# Altium schematic sheet Sheet.SchDoc
size 254 x 177 mm; SheetNumber: 1; SheetTotal: 1
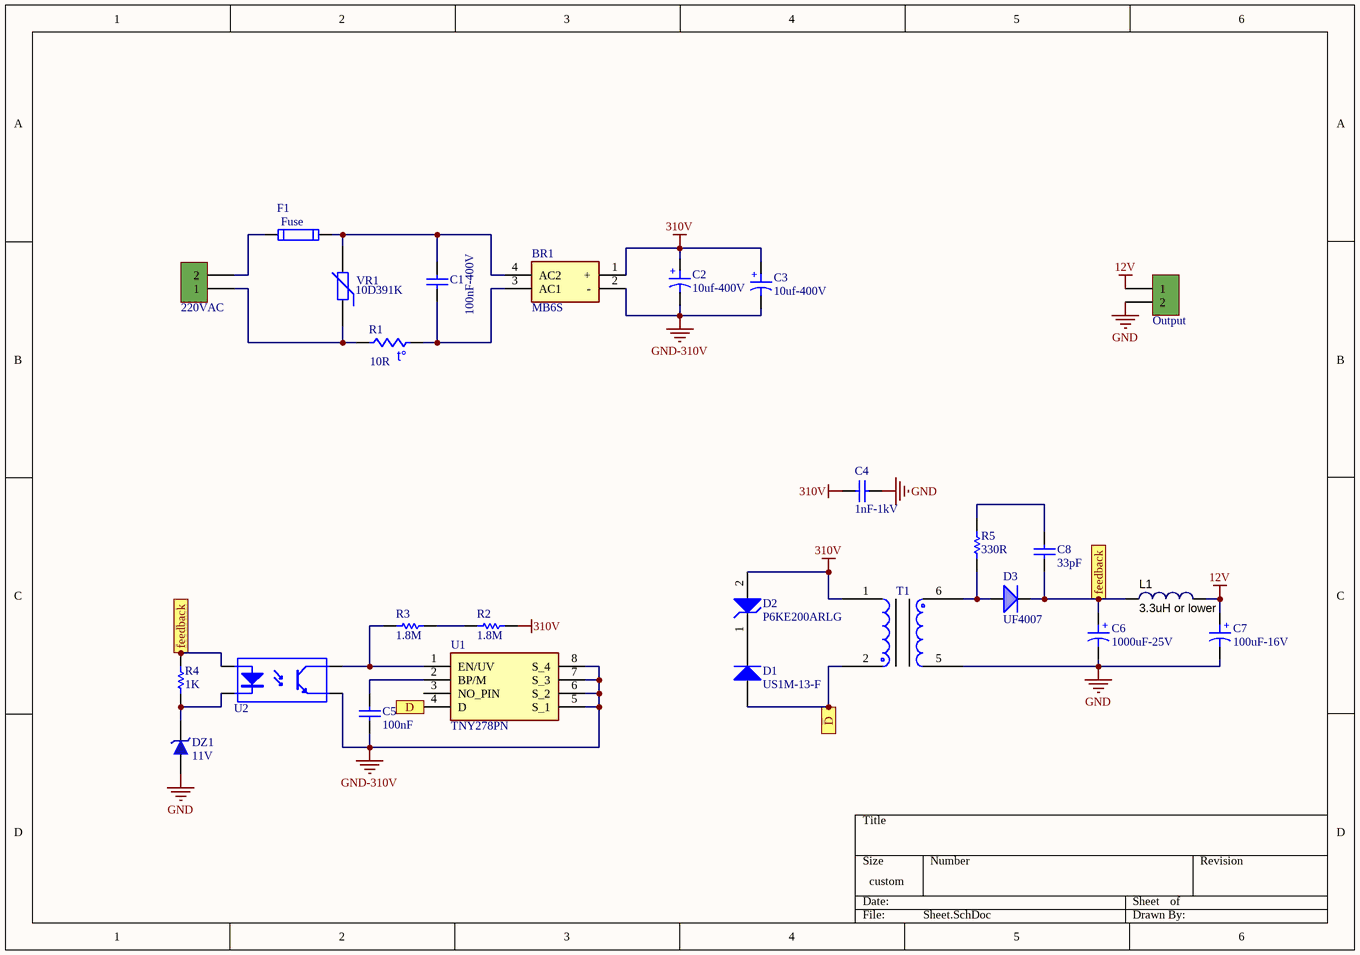
[diagram p0: Sheet.SchDoc]

## Parts
220VAC  Phoenix 2 Pin  [Phoenix_2PIN_RA_P5.08mm]  (value not drawn)
BR1  MB6S  [SOP250P700X270-4N]
C1  100nF-400V  [Cap-100nF-400V]
C2  10uf-400V  [Cap electrolitic radial 10x16-5]
C3  10uf-400V  [Cap electrolitic radial 10x16-5]
C4  1nF-1kV  [CAP1206]
C5  100nF  [CAP805]
C6  1000uF-25V  [Cap electrolitic radial 10x16-5]
C7  100uF-16V  [Cap electrolitic radial 5x11-2]
C8  33pF  [CAP805]
D1  US1M-13-F  [DIOD-SMA-2_A_V]
D2  P6KE200ARLG  [ONSC-SURMETIC40-2-017AA-01]
D3  UF4007  [DO-41]
DZ1  11V  [SOD80, LL-34]
F1  FUSE_HOLDER_METAL  [FUSE_5X20MM_4PIN]  (value not drawn)
L1  3.3uH or lower  [Inductor SMD 3x3.2mm]
Output  Phoenix 2 Pin  [Phoenix_2PIN_RA_P5.08mm]  (value not drawn)
R1  value 10R  [NTC_9]  (hidden comment: 10R[20%])
R2  1.8M  [RES0805_(2012X06L)]
R3  1.8M  [RES0805_(2012X06L)]
R4  1K  [RES0805_(2012X06L)]
R5  330R  [RES0805_(2012X06L)]
T1  EE19-12V  [PCBComponent_1]  (value not drawn)
U1  TNY278PN  [DIP762W56P254L958H406Q8N]
U2  PC817  [SOP4]  (value not drawn)
VR1  10D391K  [10D XXX]

## Ports
D (see Sheet[2C]), D (see Sheet[4D]), feedback (see Sheet[1C]), feedback (see Sheet[5C])

## Nets
12V: C7.1 L1.2 Output.1
310V: BR1.1(+) C2.1 C3.1 C4.2 D2.2(A) R2.2 T1.1
GND: C4.1 C6.2 C7.2 DZ1.1 Output.2 T1.5
GND-310V: BR1.2(-) C2.2 C3.2 C5.1 U1.5(S_1) U1.6(S_2) U1.7(S_3) U1.8(S_4) U2.3(E)
D: D1.1(A) T1.2 U1.4(D) ; port D
feedback: C6.1 C8.1 D3.2(CATHODE) L1.1 R4.2 U2.1(A) ; port feedback
Net220VAC_1: 220VAC.1 R1.1 VR1.1
Net220VAC_2: 220VAC.2 F1.1
NetBR1_3: BR1.3(AC1) C1.2 R1.2
NetBR1_4: BR1.4(AC2) C1.1 F1.2 VR1.2
NetC5_2: C5.2 U1.2(BP/M)
NetC8_2: C8.2 R5.2
NetD1_2: D1.2(K) D2.1(K)
NetD3_1: D3.1(ANODE) R5.1 T1.6
NetDZ1_2: DZ1.2 R4.1 U2.2(K)
NetR2_1: R2.1 R3.2
NetR3_1: R3.1 U1.1(EN/UV) U2.4(C)

Not connected (* = marked no-connect by the designer): U1 3(NO_PIN)

## Notes on the sheet
- (in symbol Cap ELECTROLITIC TOTAL SIZE) +
- (in symbol FUSE METAL 4PIN) Fuse
- (in symbol NTC10D-9) t°

## Library data of the parts
BR1 = MB6S: Bridge Rectifier; Manufacturer_Name: HY Electronic Corp; Datasheet Link: http://docs-emea.rs-online.com/webdocs/14bb/0900766b814bbf67.pdf; Height: 2.7mm; Manufacturer_Part_Number: MB6S
C1 = CAP CERAMIC TOTAL SIZE: CAP Ceramic Total; Designer: Ali Hafizi
C2 C3 = Cap ELECTROLITIC TOTAL SIZE: Cap electrolitic radial; Designer: Abbas Basereh; VALUE: 10uF; Data: 16-12-2016; Part. No: *
C4 C8 = CAP SMD PACKAGE: TOTAL CAPACITOR SMD PACK; Designer: Abbas Basereh; Desc.: CAP SMD TOTAL PACKAGES; VALUE: 100nF; Data: 2017-3-10
C5 = CAP SMD PACKAGE: TOTAL CAPACITOR SMD PACK; Designer: Abbas Basereh; Desc.: CAP SMD TOTAL PACKAGES; Data: 2017-3-10; VALUE: 100nF
C6 C7 = Cap ELECTROLITIC TOTAL SIZE: Cap electrolitic radial; Designer: Abbas Basereh; VALUE: 1uF; Data: 16-12-2016; Part. No: *
D1 = CMP-2000-07364-1: Ultra-Fast Rectifier, 1 A, 1.7 V, -65 to 150 degC, 2-Pin SMA, RoHS, Tape and Reel; Manufacturer: Diodes Inc; Forward Voltage: 1.7V; Reverse Recovery Time-Max: 75ns; Average Rectified Current-Max: 1A; Reverse Current-Max: 5µA; Reverse Voltage-Max [Vrrm]: 1000V; Package Description: 2-Pin Surface Mount Device, Body 4.3 x 2.605 mm; Datasheet URL: http://www.diodes.com/_files/datasheets/ds16008.pdf; Datasheet Version: Rev. 11-2, 12/2014; Package Reference: SMA-2; Mounting Technology: SurfaceMount; Manufacturer URL: http://www.diodes.com/
D2 = CMP-1061-00679-1: 600 W Peak Power Transient Voltage Suppressor, 2-Pin Surmetic(TM) 40, Pb-Free, Tape and Reel; Manufacturer: On Semiconductor; Direction: Unidirectional; PPK Max (W): 600; IR Max (uA): 5; V(BR) Typ (V): 200; RoHS: Pb-Free; ComponentLink3URL: http://www.onsemi.cn/pub_link/Collateral/017AA.PDF; PartNumber: P6KE200ARLG; ComponentLink2Description: Datasheet; PackageReference: SURMETIC40-2-017AA-01; ComponentLink3Description: Package Specification; Packing: Tape and Reel; PackageDescription: 2-Pin, Axial Lead, Diameter 3.49 mm; ComponentLink1Description: Manufacturer URL; PackageVersion: Rev. O, 09/2005; Mounting Technology: Through Hole; DatasheetVersion: Rev. 10; ComponentLink2URL: http://www.onsemi.com/pub_link/Collateral/P6KE6.8A-D.PDF; ComponentLink1URL: http://www.onsemi.com/
D3 = UF4007: Fast Switching Diodes; Manufacturer: MIC GROUP RECTIFIERS; Link to Datasheet: *; Link to Picture: *; Operating Temp: -55°C ~ 150°C; Storage Temp: -55°C ~ 150°C; Value: UF4007; ComponentLink1Description: *; ComponentLink1URL: http://www.cnmic.com; Manufacture Part #: UF4007
DZ1 = ZENER GENERAL DIODE: DIODE ZENER GENERAL; VALUE: 12V; Published: 2017-1-12; PackageVersion: 2017-1-12; PackageReference: DO 35; Publisher: Abbas Basereh; PackageDescription: DIODE GEN ZENER; ComponentLink1Description: Manufacturer Link; ComponentLink2Description: Datasheet
F1 = FUSE METAL 4PIN
L1 = Inductor 4.7µH SMD 3x3.2mm: Tolerance: ±20%; Type: Ferrite Core; SCDType: source; Value: 4µ7; Package / Case: Inductor 4.7µH SMD 3x3.2mm; Supplier 1: Digi-Key; Operating Temperature: -40°C ~ 125°C
R1 = NTC10D-9: Thick film, SMD chip Resistor; Rating: 2A; Tolerance: [20%]; Link to Datasheet: *; Link to Picture: *; Manufacture Part #: NTC10D-9; Operating Temp: -55°C ~ 200°C; ComponentLink1Description: *; ComponentLink1URL: *
R2-R5 = RES SMD PACKAGE: TOTAL SMD RESISTOR PACK; Designer: Abbas Basereh; Desc.: RES SMD PAKAGES; Data: 2017-3-10
U1 = TNY274PN: Integrated Circuit; Manufacturer_Name: Power Integrations; Datasheet Link: https://datasheet.datasheetarchive.com/originals/distributors/Datasheets-28/DSA-551610.pdf; Height: 4.06mm; Manufacturer_Part_Number: TNY274PN; Mouser Part Number: 869-TNY274PN; Mouser Price/Stock: https://www.mouser.co.uk/ProductDetail/Power-Integrations/TNY274PN?qs=%252Bk6%2F5FB6qrkuAGauUJhMww%3D%3D
U2 = PC817: General Purpose Photocoupler
VR1 = VARISTOR (VDR): VARISTORS; Manufacturer: china-canada-philipina; Designer: Abbas Basereh; VALUE: xxDxxx; Models: MOV-VDR-COV; Data: 2017-1-5; Link: digikey.com; PUBLISHER: ABBAS BASEREH